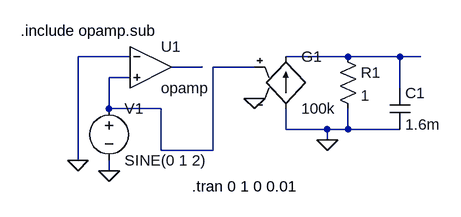
[diagram p0: schematic mdelo1.asc]
mdelo1.asc, the LTspice schematic file:
Version 4
SHEET 1 880 680
WIRE 112 48 32 48
WIRE 448 48 352 48
WIRE 528 48 448 48
WIRE 560 48 528 48
WIRE 224 64 176 64
WIRE 304 64 240 64
WIRE 112 80 80 80
WIRE 528 96 528 48
WIRE 80 128 80 80
WIRE 160 128 80 128
WIRE 352 160 352 128
WIRE 416 160 352 160
WIRE 448 160 448 128
WIRE 448 160 416 160
WIRE 528 160 448 160
WIRE 416 176 416 160
WIRE 160 192 160 128
WIRE 240 192 240 64
WIRE 240 192 160 192
WIRE 32 208 32 48
WIRE 80 224 80 208
FLAG 32 208 0
FLAG 80 224 0
FLAG 304 112 0
FLAG 416 176 0
SYMBOL res 432 32 R0
SYMATTR InstName R1
SYMATTR Value 1
SYMBOL Opamps\\opamp 144 0 R0
SYMATTR InstName U1
SYMBOL voltage 80 112 R0
WINDOW 123 0 0 Left 2
WINDOW 39 0 0 Left 2
SYMATTR InstName V1
SYMATTR Value SINE(0 1 2)
SYMBOL g 352 32 R0
SYMATTR InstName G1
SYMATTR Value 100k
SYMBOL cap 512 96 R0
SYMATTR InstName C1
SYMATTR Value 1.6m
TEXT -56 8 Left 2 !.include opamp.sub
TEXT 208 248 Left 2 !.tran 0 1 0 0.01

The netlist it stands for:
* mdelo1.asc
R1 N001 0 1
XU1 0 N003 N002 opamp Aol=100K GBW=10Meg  ; pins invin noninvin out
V1 N003 0 SINE(0 1 2)
G1 0 N001 N003 0 100k
C1 N001 0 1.6m
.include opamp.sub
.tran 0 1 0 0.01
.backanno
.end